# EAGLE board dash-hat (EAGLE 7.7.0)
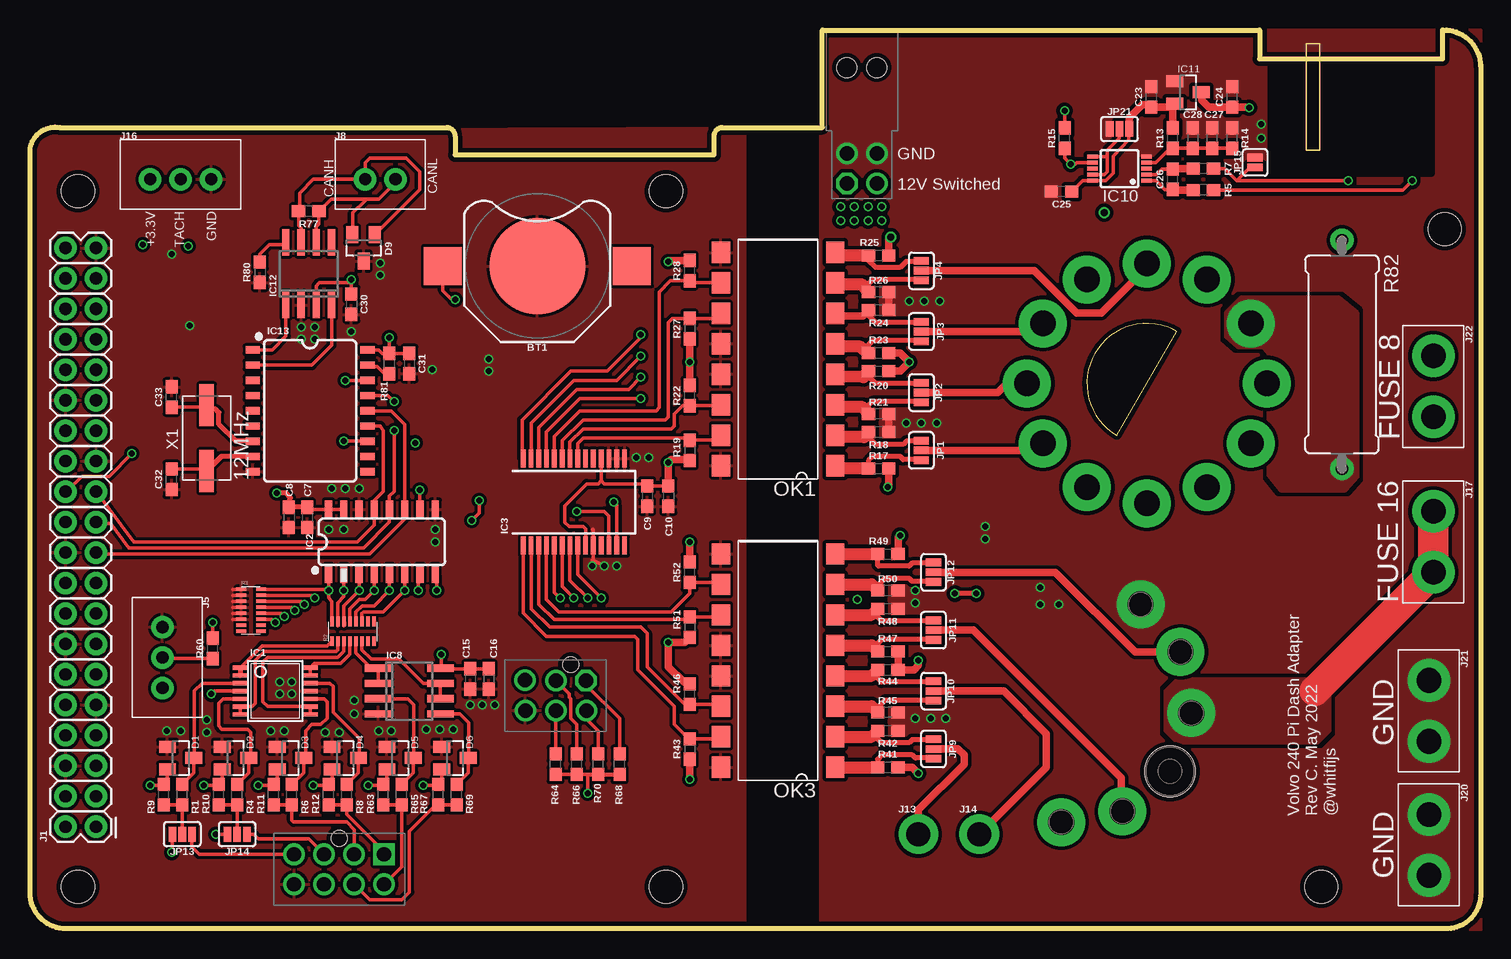
[diagram p2: board, top side]
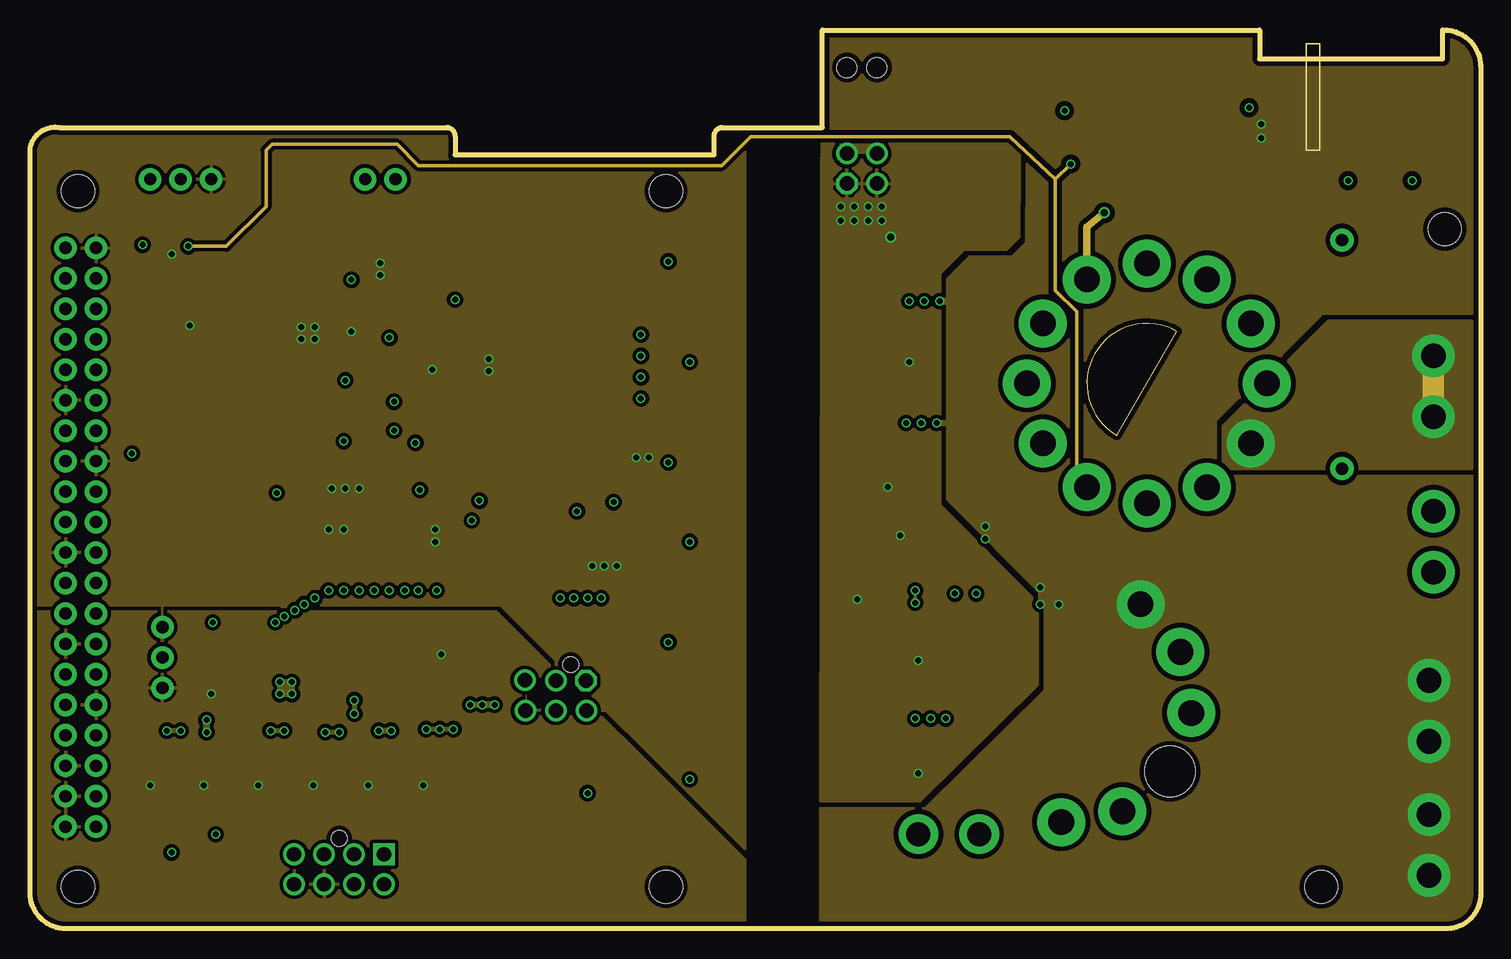
[diagram p3: board, inner layer Route2]
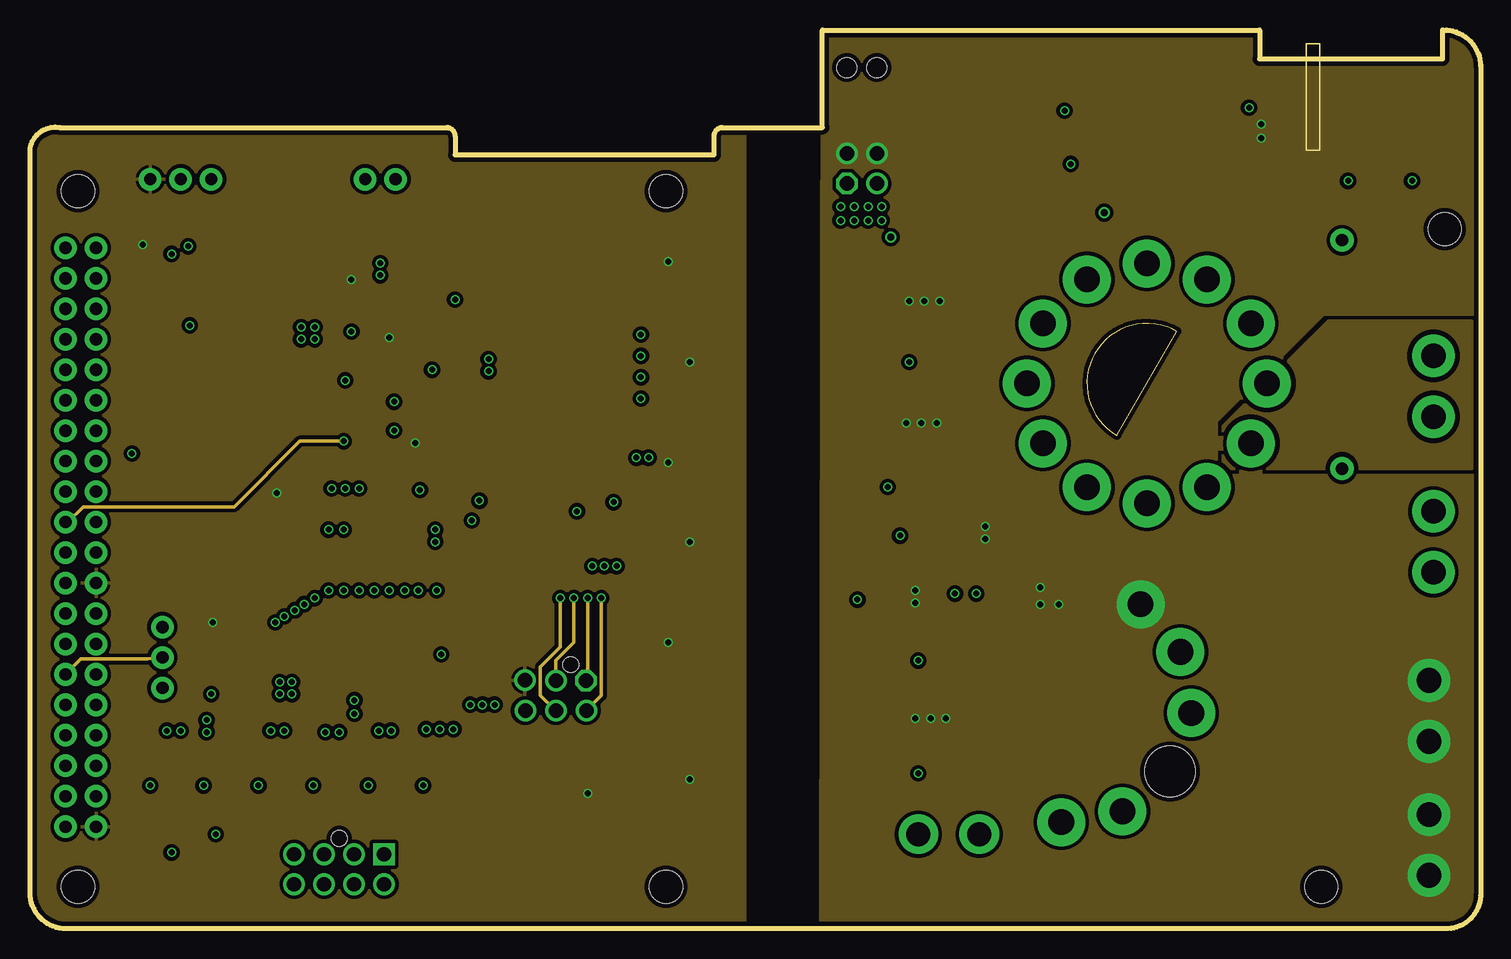
[diagram p4: board, inner layer Route15]
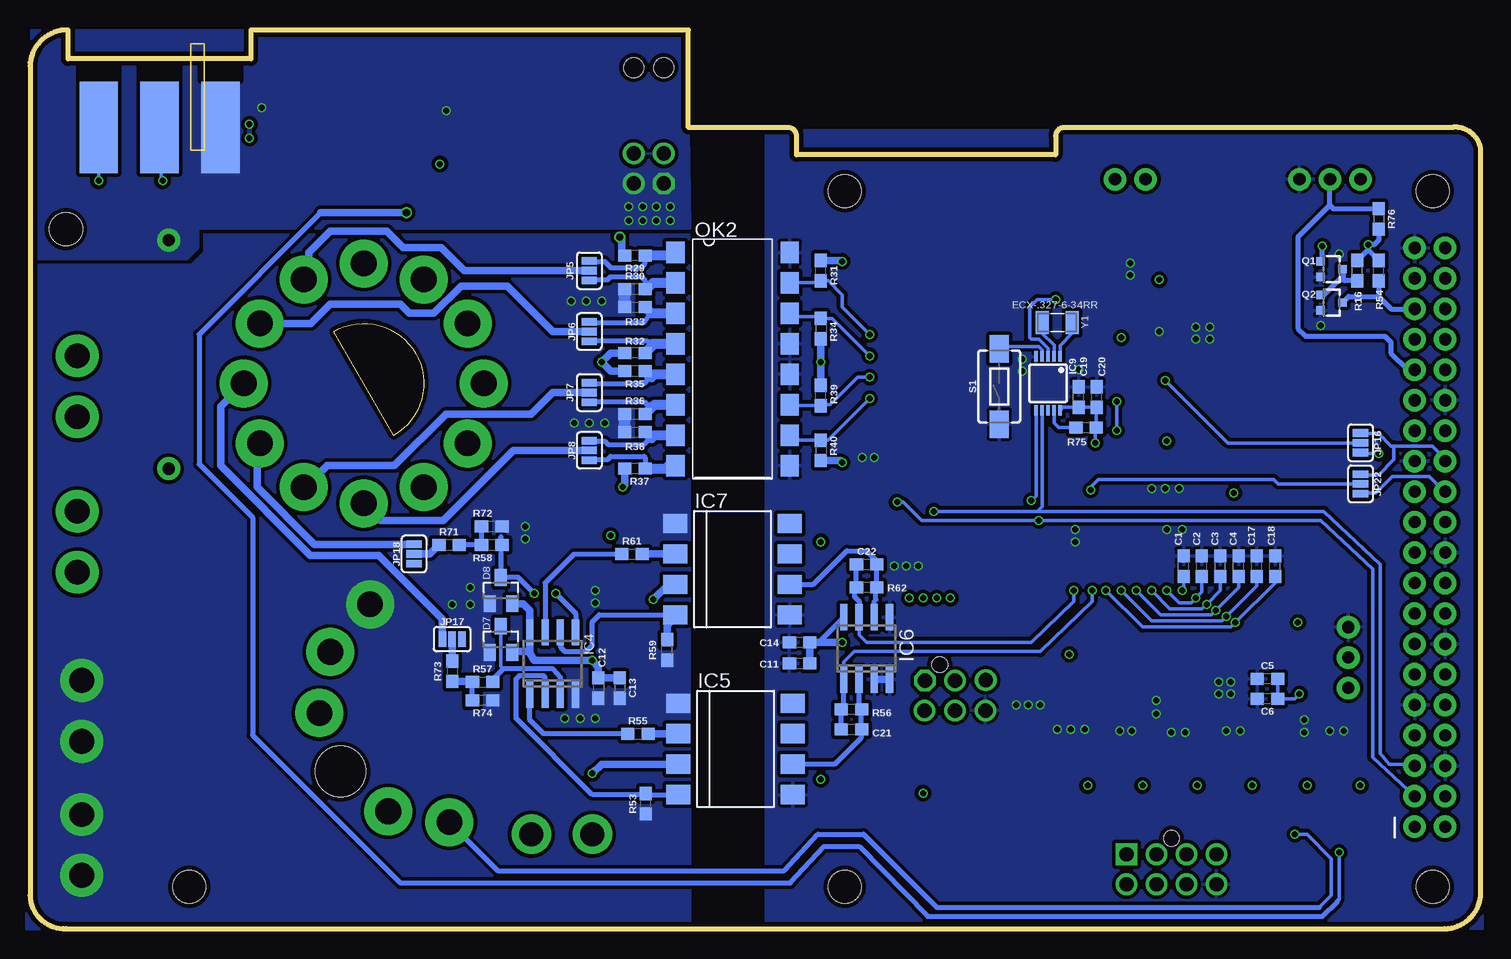
[diagram p5: board, bottom side, seen from below]

Size 120.89 x 74.93 mm. Coordinates in mm from the lower left corner, seen from the top.
Outline: 120.89,71.92 120.89,2.75 arc-90 117.89,0 3,0 arc-90 0,3 0,65.06 arc-90 2.49,66.79 34.7,66.8 arc-90 35.42,66.08 35.42,64.52 57.01,64.52 57.01,66.08 arc-90 57.73,66.8 66.03,66.8 66.03,74.93 102.47,74.93 102.47,72.52 117.71,72.52 117.71,74.93 117.76,74.93 arc-90 120.89,71.92
Copper layers (1*2*15*16): Top 0.035559375mm / dielectric 0.17018125mm / Route2 0.01778125mm / dielectric 47mil / Route15 0.01778125mm / dielectric 0.17018125mm / Bottom 0.035559375mm
Design rules "oshpark-4layer": minimum track width 5mil, minimum drill 10mil, track to track 5mil, track to pad 5mil, pad to pad 5mil, via to via 5mil, smd to smd 5mil, copper to edge 15mil, drill to drill 6mil, minimum pad ring 4mil, minimum via ring 4mil, stop-mask expansion 1.5mil, vias tented up to drill 0mil, thermal gap 10mil
Holes 2.75 mm at 53,3.5 53,61.5 4,3.5 4,61.5 107.61,3.5 117.9,58.33

## Footprints (pad centres in the part's own frame; a part is rotated, then mirrored left to right if it is on the bottom)
BATTCON_12MM = smd 8 x 8: GND 0,0 | smd 3.175 x 3.175: PWR@1 -7.874,0; PWR@2 7.874,0
0603 = smd 1.1 x 1: 1 -0.85,0; 2 0.85,0
SOT23 = smd 1 x 1.4: 1 -0.95,-1.1; 2 0.95,-1.1; 3 0,1.1
TSSOP14 = smd 1.26 x 0.36: 1 -2.918,1.95; 2 -2.918,1.3; 3 -2.918,0.65; 4 -2.918,0; 5 -2.918,-0.65; 6 -2.918,-1.3; 7 -2.918,-1.95; 8 2.918,-1.95; 9 2.918,-1.3; 10 2.918,-0.65; 11 2.918,0; 12 2.918,0.65; 13 2.918,1.3; 14 2.918,1.95
SO16 = smd 1.5 x 0.6: 1 -2.7,4.445; 2 -2.7,3.175; 3 -2.7,1.905; 4 -2.7,0.635; 5 -2.7,-0.635; 6 -2.7,-1.905; 7 -2.7,-3.175; 8 -2.7,-4.445; 9 2.7,-4.445; 10 2.7,-3.175; 11 2.7,-1.905; 12 2.7,-0.635; 13 2.7,0.635; 14 2.7,1.905; 15 2.7,3.175; 16 2.7,4.445
SSOP28 = smd 0.4 x 1.5: 1 -4.225,-3.625; 2 -3.575,-3.625; 3 -2.925,-3.625; 4 -2.275,-3.625; 5 -1.625,-3.625; 6 -0.975,-3.625; 7 -0.325,-3.625; 8 0.325,-3.625; 9 0.975,-3.625; 10 1.625,-3.625; 11 2.275,-3.625; 12 2.925,-3.625; 13 3.575,-3.625; 14 4.225,-3.625; 15 4.225,3.625; 16 3.575,3.625; 17 2.925,3.625; 18 2.275,3.625; 19 1.625,3.625; 20 0.975,3.625; 21 0.325,3.625; 22 -0.325,3.625; 23 -0.975,3.625; 24 -1.625,3.625; 25 -2.275,3.625; 26 -2.925,3.625; 27 -3.575,3.625; 28 -4.225,3.625
SO08 = smd 2.2 x 0.6: 1 -2.6,1.905; 2 -2.6,0.635; 3 -2.6,-0.635; 4 -2.6,-1.905; 5 2.6,-1.905; 6 2.6,-0.635; 7 2.6,0.635; 8 2.6,1.905
DIL8-SMD = smd 2 x 1.6: 1 -4.77,3.81; 2 -4.77,1.27; 3 -4.77,-1.27; 4 -4.77,-3.81; 5 4.77,-3.81; 6 4.77,-1.27; 7 4.77,1.27; 8 4.77,3.81
UMAX10 = smd 0.9 x 0.32: 1 -2.25,1; 2 -2.25,0.5; 3 -2.25,0; 4 -2.25,-0.5; 5 -2.25,-1; 6 2.25,-1; 7 2.25,-0.5; 8 2.25,0; 9 2.25,0.5; 10 2.25,1
SO18W = smd 0.6 x 1.2: 1 -5.08,-4.788; 2 -3.81,-4.788; 3 -2.54,-4.788; 4 -1.27,-4.788; 5 0,-4.788; 6 1.27,-4.788; 7 2.54,-4.788; 8 3.81,-4.788; 9 5.08,-4.788; 10 5.08,4.788; 11 3.81,4.788; 12 2.54,4.788; 13 1.27,4.788; 14 0,4.788; 15 -1.27,4.788; 16 -2.54,4.788; 17 -3.81,4.788; 18 -5.08,4.788
2X20 = drill 1.016 pad 1.88: 1 0,0; 2 0,2.54; 3 2.54,0; 4 2.54,2.54; 5 5.08,0; 6 5.08,2.54; 7 7.62,0; 8 7.62,2.54; 9 10.16,0; 10 10.16,2.54; 11 12.7,0; 12 12.7,2.54; 13 15.24,0; 14 15.24,2.54; 15 17.78,0; 16 17.78,2.54; 17 20.32,0; 18 20.32,2.54; 19 22.86,0; 20 22.86,2.54; 21 25.4,0; 22 25.4,2.54; 23 27.94,0; 24 27.94,2.54; 25 30.48,0; 26 30.48,2.54; 27 33.02,0; 28 33.02,2.54; 29 35.56,0; 30 35.56,2.54; 31 38.1,0; 32 38.1,2.54; 33 40.64,0; 34 40.64,2.54; 35 43.18,0; 36 43.18,2.54; 37 45.72,0; 38 45.72,2.54; 39 48.26,0; 40 48.26,2.54
MOLEX-1053102108 = drill 1.2 square: 1 3.75,1.25 | drill 1.2 pad 1.7: 2 1.25,1.25; 3 -1.25,1.25; 4 -3.75,1.25; 5 3.75,-1.25; 6 1.25,-1.25; 7 -1.25,-1.25; 8 -3.75,-1.25 | hole 1.3: 0,2.59
MOLEX-1053141204 = drill 1.2 pad 1.7 octagon: 1 -1.25,-1.25 | drill 1.2 pad 1.7: 2 1.25,-1.25; 3 -1.25,1.25; 4 1.25,1.25 | hole 1.65: -1.25,8.43; 1.25,8.43
1X03_JST-XHP = drill 1.016 pad 1.88: 1 0,0; 2 2.54,0; 3 5.08,0
VOLVO_CON_31 = drill 2.134 pad 4: 1 -10,0; 2 -8.66,-5; 3 -5,-8.66; 4 0,-10; 5 5,-8.66; 6 8.66,-5; 7 10,0; 8 8.66,5; 9 5,8.66; 10 0,10; 11 -5,8.66; 12 -8.66,5
VOLVO_CON_32 = drill 2.134 pad 4: 1 8.66,5; 2 5,8.66; 3 -8.66,5; 4 -10,0; A -5,8.66 | hole 4.2: 0,10
1X02_JST-XHP = drill 1.016 pad 1.88: 1 0,0; 2 2.54,0
MOLEX-1053101106 = drill 1.2 pad 1.7 octagon: 1 1.25,1.25 | drill 1.2 pad 1.7: 2 -1.25,1.25; 3 -3.83,1.29; 4 1.29,-1.25; 5 -1.25,-1.25; 6 -3.79,-1.25 | hole 1.3: 0,2.59
VOLVO_CONN_VSS = smd 7.62 x 3.175: 1 -5.715,0; + -5.715,-5.08; G -5.715,5.08
1X01_2MM = drill 2 pad 3.302: 1 0,0
1X02_XTRA_BIG = drill 2.057 pad 3.556: 1 -2.54,0; 2 2.54,0
SMT-JUMPER_3_NO_SILK = smd 0.635 x 1.27: 1 -0.813,0; 2 0,0; 3 0.813,0
SMT-JUMPER_2_NO_SILK = smd 0.635 x 1.27: 1 -0.406,0; 2 0.406,0
SMD16 = smd 1.524 x 1.778: 1 -4.763,8.89; 2 -4.763,6.35; 3 -4.763,3.81; 4 -4.763,1.27; 5 -4.763,-1.27; 6 -4.763,-3.81; 7 -4.763,-6.35; 8 -4.763,-8.89; 9 4.763,-8.89; 10 4.763,-6.35; 11 4.763,-3.81; 12 4.763,-1.27; 13 4.763,1.27; 14 4.763,3.81; 15 4.763,6.35; 16 4.763,8.89
SOT323 = smd 0.7 x 0.7: 1 -0.65,-0.925; 2 0.65,-0.925; 3 0,0.925
YC248 = smd 0.8 x 0.3: 1 -0.8,1.75; 2 -0.8,1.25; 3 -0.8,0.75; 4 -0.8,0.25; 5 -0.8,-0.25; 6 -0.8,-0.75; 7 -0.8,-1.25; 8 -0.8,-1.75; 9 0.85,-1.75; 10 0.85,-1.25; 11 0.85,-0.75; 12 0.85,-0.25; 13 0.85,0.25; 14 0.85,0.75; 15 0.85,1.25; 16 0.85,1.75
0617/17 = drill 1.016 pad 1.93: 1 -9.525,0; 2 9.525,0
TACTILE_SWITCH_SMD_6.0X3.5MM = smd 2.3 x 1.6: 1 -3.15,0; 2 3.15,0
ECS = smd 3.5 x 1.2: 1 -2.75,0; 2 2.75,0
ECX-34RR = smd 1.1 x 1.9: 1 -1.25,0; 2 1.25,0

## Placement (x,y rotation side)
BT1  [BATTCON_12MM]  42.28,55.24 0 top
C1  100n  [0603]  24.75,30.23 90 bottom
C2  100n  [0603]  23.23,30.23 90 bottom
C3  100n  [0603]  21.7,30.23 90 bottom
C4  100n  [0603]  20.18,30.23 90 bottom
C5  100n  [0603]  17.77,20.83 180 bottom
C6  1u  [0603]  17.77,19.18 180 bottom
C7  100n  [0603]  23.1,34.29 270 top
C8  1u  [0603]  21.57,34.29 270 top
C9  100n  [0603]  51.42,36.07 270 top
C10  1u  [0603]  53.2,36.07 270 top
C11  100n  [0603]  56.75,22.1 180 bottom
C12  100n  [0603]  73.52,20.07 270 bottom
C13  1u  [0603]  71.74,20.07 270 bottom
C14  1u  [0603]  56.75,23.88 180 bottom
C15  100n  [0603]  36.69,20.83 270 top
C16  1u  [0603]  38.21,20.83 270 top
C17  100n  [0603]  18.65,30.23 90 bottom
C18  100n  [0603]  17.13,30.23 90 bottom
C19  100n  [0603]  33.51,44.32 90 bottom
C20  1u  [0603]  31.99,44.32 90 bottom
C21  100n  [0603]  52.44,16.64 0 bottom
C22  100n  [0603]  51.17,30.35 180 bottom
C23  100n  [0603]  93.46,69.34 90 top
C24  1u  [0603]  100.19,69.34 90 top
C25  100n  [0603]  85.96,61.47 180 top
C26  10n  [0603]  95.23,62.48 90 top
C27  100n  [0603]  98.54,65.91 90 top
C28  10u  [0603]  96.89,65.91 270 top
C30  100n  [0603]  26.78,52.07 270 top
C31  100n  [0603]  31.61,47.12 270 top
C32  22p  [0603]  11.8,37.47 90 top
C33  22p  [0603]  11.8,44.32 90 top
D1  BAT54S  [SOT23]  12.56,14.22 270 top
D2  BAT54S  [SOT23]  17.13,14.22 270 top
D3  BAT54S  [SOT23]  21.7,14.22 270 top
D4  BAT54S  [SOT23]  26.27,14.22 270 top
D5  BAT54S  [SOT23]  30.85,14.22 270 top
D6  BAT54S  [SOT23]  35.42,14.22 270 top
D7  BAT54S  [SOT23]  81.65,24.13 0 bottom
D8  BAT54S  [SOT23]  81.65,28.19 0 bottom
D9  PESD1CAN  [SOT23]  27.8,56.77 180 top
IC1  LMV614  [TSSOP14]  20.43,19.81 0 top
IC2  MCP3X083008  [SO16]  29.32,32.26 90 top
IC3  MCP23017SS  [SSOP28]  45.32,35.56 0 top
IC4  LM358D  [SO08]  77.33,22.1 90 bottom
IC5  IL300  [DIL8-SMD]  62.09,14.99 0 bottom
IC6  TSV912D  [SO08]  51.17,23.37 90 bottom
IC7  IL300-DEFG-X007T  [DIL8-SMD]  62.34,29.97 0 bottom
IC8  TSV912D  [SO08]  31.61,19.81 0 top
IC9  DS1374  [UMAX10]  36.05,45.47 270 bottom
IC10  MAX9924  [UMAX10]  90.79,63.37 180 top
IC11  ZXTR2105FQ  [SOT23]  96.51,69.72 270 top
IC12  SN65HVD230D  [SO08]  23.23,54.61 90 top
IC13  MCP2515  [SO18W]  23.35,43.18 270 top
J1  CONN_20X2  [2X20]  5.5,8.5 90 top
J2  CONN_04X2  [MOLEX-1053102108]  25.77,4.95 0 top
J3  CONN_04RIGHT-ANGLE  [MOLEX-1053141204]  69.33,63.37 0 top
J5  PWM_OUT  [1X03_JST-XHP]  11.03,25.15 270 top
J6  VOLVO_CONN_31  [VOLVO_CON_31]  93.08,45.47 270 top
J7  VOLVO_CONN_32  [VOLVO_CON_32]  86.81,18.85 235 top
J8  [1X02_JST-XHP]  27.93,62.48 0 top
J9  CONN_03X2  [MOLEX-1053101106]  45.07,19.43 0 top
J11  VOLVO_CONN_VSS  [VOLVO_CONN_VSS]  110.09,72.52 90 bottom
J13  [1X01_2MM]  74.03,7.87 0 top
J14  [1X01_2MM]  79.11,7.87 0 top
J16  TACH_IN  [1X03_JST-XHP]  10.02,62.48 0 top
J17  [1X02_XTRA_BIG]  116.95,32.26 270 top
J20  [1X02_XTRA_BIG]  116.57,6.99 270 top
J21  [1X02_XTRA_BIG]  116.57,18.16 270 top
J22  [1X02_XTRA_BIG]  116.95,45.21 270 top
JP1  IN1_SEL  [SMT-JUMPER_3_NO_SILK]  74.28,39.88 90 top
JP2  IN2_SEL  [SMT-JUMPER_3_NO_SILK]  74.28,44.7 270 top
JP3  IN3_SEL  [SMT-JUMPER_3_NO_SILK]  74.28,49.78 90 top
JP4  IN4_SEL  [SMT-JUMPER_3_NO_SILK]  74.28,54.86 270 top
JP5  IN5_SEL  [SMT-JUMPER_3_NO_SILK]  74.28,54.86 270 bottom
JP6  IN6_SEL  [SMT-JUMPER_3_NO_SILK]  74.28,49.78 90 bottom
JP7  IN7_SEL  [SMT-JUMPER_3_NO_SILK]  74.28,44.7 270 bottom
JP8  IN8_SEL  [SMT-JUMPER_3_NO_SILK]  74.28,39.88 90 bottom
JP9  IN9_SEL  [SMT-JUMPER_3_NO_SILK]  75.3,14.99 90 top
JP10  IN10_SEL  [SMT-JUMPER_3_NO_SILK]  75.3,19.81 270 top
JP11  IN11_SEL  [SMT-JUMPER_3_NO_SILK]  75.3,24.89 90 top
JP12  IN12_SEL  [SMT-JUMPER_3_NO_SILK]  75.3,29.72 270 top
JP13  JUMPER-SMT_3_NO_SILK  [SMT-JUMPER_3_NO_SILK]  12.69,7.87 180 top
JP14  JUMPER-SMT_3_NO_SILK  [SMT-JUMPER_3_NO_SILK]  17.26,7.87 180 top
JP15  VSS- Jumper  [SMT-JUMPER_2_NO_SILK]  102.09,63.88 90 top
JP16  SPI_CS_SEL  [SMT-JUMPER_3_NO_SILK]  10.02,40.51 270 bottom
JP17  JUMPER-SMT_3_NO_SILK  [SMT-JUMPER_3_NO_SILK]  85.71,24.13 180 bottom
JP18  JUMPER-SMT_3_NO_SILK  [SMT-JUMPER_3_NO_SILK]  88.89,31.24 90 bottom
JP21  SPI_CS_SEL  [SMT-JUMPER_3_NO_SILK]  90.79,66.67 0 top
JP22  SPI_CS_SEL  [SMT-JUMPER_3_NO_SILK]  10.02,37.08 270 bottom
OK1  ILQ1X009  [SMD16]  62.34,47.5 180 top
OK2  ILQ1X009  [SMD16]  62.34,47.5 0 bottom
OK3  ILQ1X009  [SMD16]  62.34,22.35 180 top
Q1  310mA/60V/1.6Ω  [SOT323]  12.43,54.99 270 bottom
Q2  310mA/60V/1.6Ω  [SOT323]  12.43,52.2 270 bottom
R1  100R  [0603]  12.69,11.18 90 top
R2  8.2k  [YC248]  26.91,24.77 90 top
R3  15k  [YC248]  18.4,26.54 0 top
R4  100R  [0603]  17.26,11.18 90 top
R5  10k 1%  [0603]  97.78,61.59 180 top
R6  100R  [0603]  21.83,11.18 90 top
R7  10k 1%  [0603]  97.78,63.37 180 top
R8  100R  [0603]  26.4,11.18 90 top
R9  1k  [0603]  11.16,11.18 90 top
R10  1k  [0603]  15.73,11.18 90 top
R11  1k  [0603]  20.3,11.18 90 top
R12  1k  [0603]  24.88,11.18 90 top
R13  1k  [0603]  95.23,65.91 90 top
R14  1k  [0603]  100.19,65.91 90 top
R15  1k  [0603]  86.22,65.91 90 top
R16  20k  [0603]  10.27,54.86 90 bottom
R17  470R  [0603]  70.72,38.35 0 top
R18  470R  [0603]  70.72,41.4 180 top
R19  1k  [0603]  54.98,39.88 270 top
R20  470R  [0603]  70.72,46.48 0 top
R21  470R  [0603]  70.72,42.93 180 top
R22  1k  [0603]  54.98,44.45 90 top
R23  470R  [0603]  70.72,48.01 0 top
R24  470R  [0603]  70.72,51.56 180 top
R25  470R  [0603]  70.72,56.13 0 top
R26  470R  [0603]  70.72,53.09 180 top
R27  1k  [0603]  54.98,50.04 270 top
R28  1k  [0603]  54.98,54.86 90 top
R29  470R  [0603]  70.47,56.13 180 bottom
R30  470R  [0603]  70.47,53.34 0 bottom
R31  1k  [0603]  54.98,54.86 90 bottom
R32  470R  [0603]  70.47,48.01 180 bottom
R33  470R  [0603]  70.47,51.82 0 bottom
R34  1k  [0603]  54.98,50.04 270 bottom
R35  470R  [0603]  70.47,46.48 180 bottom
R36  470R  [0603]  70.47,42.93 0 bottom
R37  470R  [0603]  70.47,38.35 180 bottom
R38  470R  [0603]  70.47,41.4 0 bottom
R39  1k  [0603]  54.98,44.45 90 bottom
R40  1k  [0603]  54.98,39.88 270 bottom
R41  470R  [0603]  71.49,13.46 0 top
R42  470R  [0603]  71.49,16.51 180 top
R43  1k  [0603]  54.98,14.99 270 top
R44  470R  [0603]  71.49,21.59 0 top
R45  470R  [0603]  71.49,18.03 180 top
R46  1k  [0603]  54.98,19.56 90 top
R47  470R  [0603]  71.49,23.11 0 top
R48  470R  [0603]  71.49,26.67 180 top
R49  470R  [0603]  71.49,31.24 0 top
R50  470R  [0603]  71.49,28.19 180 top
R51  1k  [0603]  54.98,25.15 270 top
R52  1k  [0603]  54.98,29.72 90 top
R53  100k 1%  [0603]  69.58,10.41 90 bottom
R54  20k  [0603]  8.49,54.86 90 bottom
R55  270 1%  [0603]  70.22,16.26 0 bottom
R56  20k 1%  [0603]  52.44,18.29 180 bottom
R57  100R  [0603]  83.17,20.57 0 bottom
R58  100R  [0603]  82.41,32 0 bottom
R59  100k 1%  [0603]  67.8,23.24 90 bottom
R60  20k  [0603]  15.23,23.37 90 top
R61  270 1%  [0603]  70.72,31.24 0 bottom
R62  20k 1%  [0603]  51.17,28.45 180 bottom
R63  1k  [0603]  29.45,11.18 90 top
R64  1k  [0603]  43.8,13.72 90 top
R65  100R  [0603]  30.97,11.18 90 top
R66  1k  [0603]  45.58,13.72 90 top
R67  1k  [0603]  34.02,11.18 90 top
R68  1k  [0603]  49.13,13.72 90 top
R69  100R  [0603]  35.54,11.18 90 top
R70  1k  [0603]  47.36,13.72 90 top
R71  100k 1%  [0603]  85.96,32 0 bottom
R72  100k 1%  [0603]  82.41,33.53 180 bottom
R73  100k 1%  [0603]  85.71,21.46 270 bottom
R74  100k 1%  [0603]  83.17,19.05 180 bottom
R75  1k  [0603]  32.88,41.78 0 bottom
R76  20k  [0603]  8.49,59.18 270 bottom
R77  120 1%  [0603]  23.23,59.82 180 top
R80  1k  [0603]  19.16,54.74 270 top
R81  20k  [0603]  29.96,47.12 90 top
R82  RES_D+  [0617/17]  109.33,47.88 90 top
S1  RST_SW  [TACTILE_SWITCH_SMD_6.0X3.5MM]  40.12,45.21 90 bottom
X1  12MHz  [ECS]  14.72,40.89 90 top
Y1  ECX-.327-6-34RR  [ECX-34RR]  35.29,50.55 0 bottom

## Tracks (layer width: path | path; a pad name or v marks a point on that pad's centre or on a via)
3.3V  (via drill 0.5)
  Top 0.305: IC2.15 IC2.16 23.28,34.96 C7.1 | C10.1 C9.1 arc-90 51.25,37.08 47.86,37.08 47.6,37.35 | 47.6,37.35 IC3.18 | IC3.9 46.3,33.31 46.09,33.53 44.92,33.53 44.56,33.89 44.56,35.25 46.39,37.08 47.33,37.08 47.6,37.35 | R60.2 v15.23,25.53 | IC13.18 29.07,48.26 29.36,47.97 R81.2 | R81.2 C31.1 | IC12.3 23.86,53.59 24.12,53.85 26.69,53.85 26.78,53.76 C30.1 v26.78,54.1 | v29.96,49.28 R81.2 | R64.1 R66.1 R70.1 R68.1 49.09,12.83 46.47,12.83 v46.47,11.3
  Top 0.406: IC2.16 24.92,35 | C7.1 C8.1 21.7,35.94 21.36,36.32 v20.56,36.32
  Top 0.61: R52.2 v54.98,32.26 | R51.2 54.56,23.88 v53.2,23.88 53.2,21.84 54.47,20.57 54.98,20.57 R46.2 | R43.2 v54.98,12.45 | C10.1 v53.2,38.86 53.45,39.12 54.89,39.12 R40.2 | R39.2 v54.98,47.24 R34.2 | R31.2 53.29,55.71 v53.2,55.63
  Bottom 0.305: IC9.10 34.8,43.47 C19.1 C20.1 32.03,43.43 R75.2 32.12,41.74 v32.12,40.51
  Bottom 0.406: IC6.8 55.16,23.88 55.74,23.88 | R54.2 9.38,56.6 | R16.2 9.38,56.6 | 9.38,56.6 v9.38,57.02 8.88,57.02 8.49,57.4 R76.2
  Bottom 0.61: C11.1 C14.1 55.74,23.88 v53.2,23.88 | R40.2 53.36,39.03 v53.2,38.86 | R39.2 v54.98,47.24 R34.2 | R31.2 53.29,55.71 v53.2,55.63
  pour Route15 (isolate 0.305): 0.11,66.8 59.55,67.06 59.55,0.25 0.11,0
5V  (via drill 0.5)
  Top 0.305: D1.2 11.46,12.2 R9.2 11.2,11.94 v10.02,11.94 | D2.2 16.03,12.2 R10.2 15.77,11.94 v14.46,11.94 | D3.2 20.6,12.2 R11.2 20.34,11.94 v19.04,11.94 | D4.2 25.17,12.2 R12.2 24.92,11.94 v23.61,11.94 | D5.2 29.75,12.2 R63.2 29.49,11.94 v28.18,11.94 | D6.2 34.32,12.2 R67.2 34.06,11.94 v32.75,11.94 | IC1.4 15.35,19.81 v15.1,19.56 | IC8.8 34.25,21.68 | 34.25,21.68 C15.1 C16.1 | 34.25,21.68 34.27,21.71 v34.27,22.86
  Bottom 0.305: v15.1,19.56 15.48,19.18 C6.1 C5.1
  pour Route2 (isolate 0.305): -0.14,26.42 38.86,26.42 59.55,5.73 59.55,0 -0.14,0
12V  (via drill 0.5, 0.6)
  Top 0.305: 97.78,69.55 IC11.3 | 101.55,68.49 v101.59,68.45 | R15.2 v86.22,68.2
  Top 0.61: R25.2 71.57,57.49 v71.74,57.66 | R23.2 72.5,48.01 v73.26,47.24 72.5,46.48 R20.2 | R17.2 71.57,36.92 v71.49,36.83 | R49.2 72.34,32.6 v72.5,32.77 | v74.03,22.35 74.03,21.95 73.67,21.59 R44.2 R47.2 | R41.2 73.52,13.46 v74.03,12.95 | C24.1 101.55,68.49 | C24.1 100.15,68.45 | 97.61,69.39 IC11.3 97.65,69.68 97.65,69.09 98.24,68.49 C24.1
  Bottom 0.61: C13.1 C12.1 73.52,21.84 v74.03,22.35 78.85,22.35 79.23,22.99 79.23,23.11 | 79.23,23.11 IC4.8 79.23,26.54 79.78,27.09 D8.2 | R37.2 71.32,37 v71.49,36.83 | R35.2 72.5,46.48 v73.26,47.24 72.5,48.01 R32.2 | IC7.3 67.68,28.7 v68.95,27.43 | IC5.3 73.26,13.72 v74.03,12.95 | R29.2 R25.2 71.57,57.49 v71.74,57.66 | D7.2 80.61,23.11 79.23,23.11
  other vias: 67.55,59.05 67.55,60.2 68.69,60.2 68.69,59.05 69.84,59.05 69.84,60.2 70.98,60.2 70.98,59.05
  pour Bottom (isolate 0.305, no thermals): 66.15,74.8 65.9,58.42 106.92,58.42 106.92,56.8 107.83,55.88 120.51,55.88 120.76,74.93
  pour Route2 (isolate 0.305): 82.54,75.06 82.41,57.66 81.39,56.64 77.84,56.64 75.8,54.61 75.8,35.31 83.93,27.18 83.93,20.32 74.15,10.67 65.9,10.67 66.03,75.06
12V-FUSE_8
  Route2 1.778: J22.1 J22.2
  Bottom 0.61: J6.9 101.97,40.24 101.97,36.83 97.19,32.05 JP18.3
  pour Route2 (isolate 0.406, no thermals): 99.43,38.35 99.43,41.91 108.19,50.67 120.13,50.67 120.13,38.35
12V-FUSE_16
  Top 2.54: J17.1 J17.2 107.05,19.81
  pour Top (isolate 0.305, no thermals): 108.32,20.83 95.62,20.83 94.6,19.81 94.6,16.51 95.62,15.49 107.3,15.49 108.32,16.51
!CAN_SPI_CS  (via drill 0.5)
  Top 0.305: IC13.16 v26.27,45.72
  Bottom 0.305: v26.27,45.72 21.07,40.51 JP16.2
!SPI_CS  (via drill 0.5)
  Top 0.305: v32.5,36.58 IC2.10
  Bottom 0.305: JP22.2 16.88,37.08 17.26,37.47 31.86,37.47 32.5,36.83 v32.5,36.58
AC_RELAY/VSS_TO_ECU  (via drill 0.5)
  Top 0.305: IC10.7 87.23,63.87 87.11,63.75 v86.73,63.75 86.22,64.26 R15.1
  Route2 0.305: v86.73,63.75 85.46,62.48 | 85.46,62.48 85.46,53.21 87.23,51.44 87.23,38.35 88.08,37.51 J6.6 | 85.46,62.48 81.65,66.04 60.06,66.04 57.64,63.63 32.37,63.63 30.59,65.41 20.18,65.41 19.67,64.9 19.67,60.2 16.37,56.9 v13.19,56.9 13.19,57.15
  Bottom 0.406: Q1.1 13.19,55.8 v13.19,56.9
ADC1_IN  (via drill 0.5)
  Top 0.305: IC2.1 24.88,28.32 | 24.88,28.32 v24.88,28.19 | v24.88,28.19 24.88,27.56 25.16,27.28 R2.16 | 24.85,28.29 arc90 24.88,28.32 | R3.16 24.78,28.29 v24.88,28.19
  Bottom 0.305: C1.1 24.75,28.32 v24.88,28.19
ADC2_IN  (via drill 0.5)
  Top 0.305: IC2.2 v26.15,28.19 26.15,27.69 25.64,27.18 25.64,25.23 R2.15 | R3.15 23.5,27.79 v23.73,27.56
  Bottom 0.305: C2.1 23.23,28.07 v23.73,27.56 24.12,27.18 25.13,27.18 v26.15,28.19
ADC3_IN  (via drill 0.5)
  Top 0.305: IC2.3 v27.42,28.19 26.15,26.92 26.15,25.25 arc90 R2.14 | R3.14 22.6,27.29 v22.84,27.05
  Bottom 0.305: v27.42,28.19 25.89,26.67 23.23,26.67 v22.84,27.05 21.7,28.19 C3.1
ADC4_IN  (via drill 0.5)
  Top 0.305: IC2.4 v28.69,28.19 27.93,27.43 27.42,27.43 26.66,26.67 R2.13 | R3.13 21.83,26.79 v22.08,26.54
  Bottom 0.305: v28.69,28.19 26.66,26.16 22.46,26.16 v22.08,26.54 20.18,28.45 C4.1
ADC5_IN  (via drill 0.5)
  Top 0.305: 29.96,27.94 v29.96,28.19 | v29.96,28.19 IC2.5 | R3.12 20.94,26.29 v21.19,26.04 | R2.12 27.16,25.65 27.16,26.42 27.67,26.92 28.69,26.92 v29.96,28.19
  Bottom 0.305: v29.96,28.19 27.42,25.65 21.57,25.65 v21.19,26.04 18.65,28.57 C17.1
ADC6_IN  (via drill 0.5)
  Top 0.305: IC2.6 v31.23,28.19 29.45,26.42 27.8,26.42 27.66,26.28 R2.11 | R3.11 20.17,25.79 v20.43,25.53
  Bottom 0.305: v31.23,28.19 28.18,25.15 20.81,25.15 v20.43,25.53 17.13,28.83 C18.1
BLINKER_LEFT_P
  Bottom 0.61: JP7.2 77.33,44.7 79.11,42.93 86.22,42.93 90.54,38.61 96.12,38.61 97.93,36.81 J6.8
BLINKER_RIGHT_P
  Bottom 0.61: J6.7 91.65,34.04 86.47,34.04 80.63,39.88 JP8.2
BRAKE_FAILURE_N
  Top 0.61: JP4.2 83.68,54.86 87.23,51.31 89.27,51.31 92.7,54.74 92.7,55.09 J6.1
BULB_FAILURE_N
  Bottom 0.61: J6.12 97.65,54.55 97.65,56.39 95.87,58.17 91.17,58.17 89.77,56.77 86.6,56.77 84.69,54.86 JP5.2
CANH
  Top 0.305: IC12.7 22.59,58.42 22.38,58.63 R77.2 22.46,59.91 22.46,61.34 23.61,62.48 J8.1 27.93,63.88 28.31,64.26 31.35,64.26 32.5,63.12 32.5,61.62 D9.1
CANL
  Top 0.305: IC12.6 23.86,58.55 24.08,58.76 R77.1 25.09,60.83 27.93,60.83 | D9.2 26.91,57.93 26.91,59.69 27.93,60.71 27.93,60.83 | 27.93,60.83 29.07,60.83 30.46,62.23 J8.2
CHARGING_N
  Bottom 0.61: JP6.2 77.33,49.78 81.14,53.59 84.95,53.59 87.23,51.31 89.27,51.31 90.03,52.07 95.87,52.07 97.47,50.47 J6.11
  pour Top (isolate 0.305, no thermals): 103.24,48.01 103.24,37.82 104.23,36.58 109.61,36.58 110.6,37.69 110.6,51.31 109.06,52.58 100.95,52.58 99.68,51.31 99.68,49.4 100.7,48.51 102.73,48.51
CHECK_ENGINE_N
  Top 0.61: JP10.2 81.14,19.81 84.69,16.26 84.69,13.46 J14.1
CONN_32_PIN3
  Top 0.61: JP12.2 85.46,29.72 92.1,23.08 J7.3
COOLANT_TEMP_SENSOR  (via drill 0.5, 0.6)
  Top 0.305: v11.8,6.35 11.87,6.43 JP13.3
  Route2 0.61: J6.2 88.08,58.5 v89.52,59.69
  Bottom 0.305: 11.92,2.29 11.8,2.41 v11.8,6.35
  Bottom 0.406: 96.64,59.69 106.79,49.54 106.79,38.73 102.35,34.29 102.35,16.13 90.03,3.81 57.52,3.81 54.72,6.86 51.8,6.86 46.09,1.02 13.19,1.02 11.92,2.29
  Bottom 0.61: v89.52,59.69 96.64,59.69
DIMMER_VOUT
  Bottom 0.61: J6.10 105.01,43.53 105.01,38.61 97.52,31.11 91.81,31.11 86.52,25.83 JP17.3
FUEL_LVL_SENDER  (via drill 0.5)
  Top 0.305: v15.48,7.87 JP14.3
  Bottom 0.305: 13.45,1.78 12.43,2.79 12.43,5.84 14.46,7.87 v15.48,7.87
  Bottom 0.406: 85.94,8.86 81.9,4.83 58.02,4.83 55.23,7.87 51.42,7.87 45.32,1.78 13.45,1.78
  Bottom 0.61: J7.1 85.94,8.86
GND  (via drill 0.5)
  Top 0.305: IC3.10 46.95,33.27 46.85,33.27 arc-90 46.95,33.17 46.95,30.84 46.85,30.73 v47.86,30.23 | 16.88,28.3 R3.1 | 16.88,27.79 R3.2 | 16.88,27.29 R3.3 | 17.38,26.8 16.88,26.8 16.88,26.79 R3.4 | 16.88,26.29 17.38,26.29 R3.5 | 16.88,25.78 17.38,25.78 17.38,25.79 R3.6
  Bottom 0.61: IC6.3 IC6.4
  other vias: 50.53,39.27 51.55,39.27 27.42,36.7 26.27,36.7 24.88,33.27 26.15,33.27 46.85,30.23 48.88,30.23 33,16.64 35.29,16.64 34.15,16.64 38.21,47.5 33.77,33.27 33.77,32.26 37.7,18.67 38.72,18.67 36.69,18.67 25.13,36.7 11.8,56.26 13.32,50.29 21.83,19.56 20.81,19.56 21.83,20.57 20.81,20.57 20.05,16.51 21.19,16.51 14.72,16.38 14.72,17.4 25.77,16.38 24.62,16.38 12.56,16.51 11.42,16.51 27.04,17.91 27.04,19.05 30.08,16.51 29.07,16.51 38.21,46.48 22.59,50.16 22.59,49.15 23.73,49.15 23.73,50.16 29.2,55.5 29.2,54.48 26.78,49.78 33.51,46.61
  pour Top (isolate 0.254): 0.62,0.25 0.37,66.55 59.55,66.8 59.55,0.25
  pour Bottom (isolate 0.305): -0.14,0 0.37,66.55 59.55,66.55 59.55,0.25
  pour Route2 (isolate 0.305, rank 2): 0.62,0.51 59.55,0.51 59.55,66.55 0.37,66.55
GND-ISO  (via drill 0.5)
  Top 0.61: R21.1 R18.1 | R26.1 R24.1
  Bottom 1.016: R38.1 R36.1 | R33.1 R30.1
  other vias: 73.77,17.53 75.04,17.53 76.31,17.53 73.01,42.16 74.28,42.16 75.55,42.16 73.26,52.32 74.53,52.32 75.8,52.32 79.61,32.51 79.61,33.53 73.77,28.19 73.77,27.18 84.19,27.05 84.19,28.45 85.71,27.05 102.6,67.06 102.6,65.91
  pour Top (isolate 0.305, rank 2, no thermals): 65.9,74.93 109.05,74.93 120.88,74.9 120.9,-0.1 106.13,0 65.9,0
  pour Bottom (isolate 0.305, rank 2, no thermals): 120.88,74.97 121.15,0.01 106.02,0 65.9,0 66.03,74.93 109.5,74.93
  pour Route15 (isolate 0.305, rank 2, no thermals): 66.03,74.93 121.02,75.06 120.89,0.13 65.9,0
  pour Route2 (isolate 0.406, rank 2, no thermals): 66.03,74.93 65.9,0 120.89,0 120.89,74.93
GPIO6
  Top 0.406: J1.31
  Bottom 0.406: 12.56,60.33 15.23,57.66 15.23,50.04 14.59,49.4 7.99,49.4 7.48,48.9 7.48,48.01 6.07,46.6 J1.31 | 12.56,62.1 J16.2 12.56,60.33 | 12.56,60.33 12.27,60.03 R76.1
GPIO17
  Top 0.406: J1.11 5.84,21.54
GPIO18
  Top 0.305: J5.2 11.58,22.52 R60.1
  Route15 0.305: J1.12 4.24,22.48 9.76,22.48 J5.2
GPIO19
  Bottom 0.406: R54.1 8.49,52.7 | 8.49,52.7 7.47,51.68 J1.35 | Q2.3 11,52.7 8.49,52.7
GPIO25  (via drill 0.5)
  Top 0.305: IC13.12 v26.15,40.64
  Route15 0.305: v26.15,40.64 22.46,40.64 17,35.18 4.43,35.18 3.15,33.9 J1.22
GPIO27
  Top 0.406: J1.13 6.07,23.16
HIGH_BEAM_P
  Top 0.61: J6.3 83.73,49.78 JP3.2
IN1_12V_SIGNAL
  Bottom 0.406: R74.2 R57.1
  Bottom 0.61: R57.1 84.06,20.61 R73.2
IN1N
  Top 0.406: JP1.3 74.23,40.64 73.01,40.64 72.76,40.39 70.47,40.39 69.87,40.98 R18.2
  Top 1.016: R18.2 69.49,40.99 66.91,40.99 OK1.2
IN1P
  Top 0.406: JP1.1 74.23,39.12 72.76,39.12 72.5,39.37 70.22,39.37 69.87,39.03 R17.1
  Top 1.016: R17.1 67.42,38.35 67.17,38.44 OK1.1
IN2N
  Top 0.406: JP2.3 74.23,43.94 70.22,43.94 69.87,43.6 R21.2
  Top 1.016: R21.2 69.39,43.49 67.42,43.49 OK1.3
IN2P
  Top 0.406: JP2.1 74.23,45.47 70.47,45.47 69.87,46.06 R20.1
  Top 1.016: R20.1 69.45,45.97 67.17,46.04 OK1.4
IN3N
  Top 0.406: JP3.3 74.23,50.55 70.47,50.55 69.87,51.14 R24.2
  Top 0.61: 67.17,51.09 69.4,51.09 R24.2
  Top 1.016: 67.17,51.09 OK1.6
IN3P
  Top 0.406: JP3.1 74.23,49.02 70.22,49.02 69.87,48.68 R23.1
  Top 1.016: R23.1 69.2,48.51 67.42,48.54 OK1.5
IN4N
  Top 0.406: JP4.3 74.23,54.1 70.22,54.1 69.87,53.76 R26.2
  Top 1.016: R26.2 69.39,53.69 67.17,53.69 OK1.7
IN4P
  Top 0.406: JP4.1 74.23,55.63 73.01,55.63 72.5,55.12 70.47,55.12 69.87,55.71 R25.1
  Top 1.016: R25.1 67.17,56.13 67.1,56.2 OK1.8 67.17,56.44
IN5N
  Bottom 0.406: 69.73,53.36 R30.2 69.62,54.01 69.96,54.36 72.5,54.36 72.76,54.1 74.23,54.1 JP5.3
  Bottom 0.61: R30.2 69.52,53.44 69.38,53.44
  Bottom 0.813: 69.38,53.44 68.97,53.85 OK2.2
IN5P
  Bottom 0.406: JP5.1 74.23,55.63 73.01,55.63 72.5,55.12 69.96,55.12 69.62,55.46 R29.1
  Bottom 0.61: R29.1 69.59,56.11 69.59,55.98
  Bottom 0.813: 69.59,55.98 69.44,56.13 | OK2.1 67.36,56.13 R29.1
IN6N
  Bottom 0.406: JP6.3 74.23,50.55 69.71,50.55 69.16,51.35
  Bottom 0.813: R33.2 69.16,51.35 69.11,51.31 OK2.3
IN6P
  Bottom 0.406: JP6.1 73.98,49.02 69.45,49.02 69.11,48.68 69.11,48.51
  Bottom 0.813: R32.1 69.11,48.51 | 69.11,48.68 69.02,48.77 OK2.4
IN7N
  Bottom 0.406: JP7.3 74.23,43.94 69.71,43.94 69.2,43.43 69.11,43.43
  Bottom 0.813: R36.2 69.11,43.43 68.86,43.69 OK2.6
IN7P
  Bottom 0.406: 69.11,45.97 69.45,45.97 69.45,45.72 69.71,45.47 74.23,45.47 JP7.1
  Bottom 0.813: R35.1 69.11,45.97 68.86,46.23 OK2.5
IN8N
  Bottom 0.406: JP8.3 74.23,40.64 73.01,40.64 72.76,40.39 69.71,40.39 69.2,40.89 69.11,40.89
  Bottom 0.813: R38.2 69.11,40.89 68.86,41.15 OK2.7
IN8P
  Bottom 0.406: JP8.1 74.23,39.12 72.76,39.12 72.5,39.37 69.71,39.37 69.62,39.28 R37.1
  Bottom 0.813: R37.1 67.93,38.35 67.68,38.61 OK2.8
IN9N
  Top 0.406: JP9.3 75.25,15.75 73.52,15.75 73.26,15.49 70.98,15.49 70.64,15.84 R42.2
  Top 1.016: R42.2 70.13,16 OK3.2
IN9P
  Top 0.406: JP9.1 75.25,14.22 73.77,14.22 73.52,14.48 70.98,14.48 70.64,14.14 R41.1
  Top 1.016: OK3.1 R41.1
IN10N
  Top 0.406: JP10.3 75.25,19.05 71.23,19.05 70.64,18.45 R45.2
  Top 1.016: R45.2 70.13,18.54 OK3.3
IN10P
  Top 0.406: JP10.1 75.25,20.57 70.98,20.57 70.47,21.08 70.13,21.08
  Top 1.016: R44.1 70.13,21.08 OK3.4
IN11N
  Top 0.406: JP11.3 75.25,25.65 70.98,25.65 70.64,26 R48.2
  Top 1.016: R48.2 70.13,26.16 OK3.6
IN11P
  Top 0.406: JP11.1 75.25,24.13 70.98,24.13 70.64,23.79 R47.1
  Top 1.016: R47.1 70.13,23.62 OK3.5
IN12N
  Top 0.406: JP12.3 75.25,28.96 73.52,28.96 73.26,29.21 71.23,29.21 70.64,28.61 R50.2
  Top 1.016: R50.2 70.13,28.7 OK3.7
IN12P
  Top 0.406: JP12.1 75.25,30.48 73.52,30.48 73.26,30.23 70.72,30.23 70.64,30.31 R49.1
  Top 1.016: OK3.8 R49.1
N$1
  Top 0.305: IC1.1 19.34,23.58 24.78,23.58 R2.1
  Top 0.406: IC1.1 IC1.2
N$2
  Bottom 0.305: 81.44,21.67 81.65,21.87 D7.3
  Bottom 0.406: IC4.3 76.69,20.95 77.33,21.67 81.44,21.67 82.32,20.79 R57.2 82.66,20.92
N$3
  Top 0.305: R1.2 13.66,13 D1.3 13.7,14.27 13.7,19.81 14.35,20.46 IC1.3
N$4
  Bottom 0.406: IC4.2 77.96,20.95 78.09,21.08 80.12,21.08 80.38,20.83 80.38,17.53 74.03,11.18 69.8,11.18 R53.2 69.62,11.18 IC5.4
  Bottom 0.61: IC5.4 66.95,11.26
N$5
  Top 0.305: IC1.7 IC1.6 17.54,18.54 18.53,18.54 18.78,18.8 18.78,22.35 19.54,23.11 25.51,23.11 25.66,23.26 R2.2
N$6  (via drill 0.5)
  Top 0.406: v78.85,27.94 v77.07,27.94
  Bottom 0.406: v77.07,27.94 75.42,26.29 IC4.5 | R58.2 81.65,32.68 D8.3 80.21,29.29 v78.85,27.94
N$7
  Top 0.305: R4.2 18.23,13 D2.3 18.4,14.39 18.4,16.38 18.15,16.64 15.99,16.64 15.73,16.89 15.73,18.8 16.1,19.16 IC1.5
N$8
  Bottom 0.406: IC7.4 67.68,26.16 73.46,26.16 74.03,25.59 74.03,23.62 74.53,23.11 76.31,23.11 76.69,23.5 IC4.6
  Bottom 0.61: R59.2 67.8,25.27 67.68,25.4 67.68,26.16
N$9
  Top 0.305: IC1.8 IC1.9 23.32,18.54 19.8,18.54 19.42,18.92 19.42,22.23 19.8,22.61 25.64,22.61 26.16,23.13 R2.3
N$10
  Bottom 0.406: R56.1 51.8,18.25 | 51.8,18.25 IC6.2 | 51.8,18.25 51.67,18.12 51.67,16.73 C21.2 51.59,15.96 53.83,13.72 IC5.6
N$11
  Top 0.305: R6.2 22.8,13 D3.3 22.97,14.39 22.97,16.51 23.48,17.02 24.24,17.02 24.75,17.53 24.75,18.92 24.51,19.16 IC1.10
N$12
  Top 0.305: IC12.8 21.13,57.02 19.92,57.02 19.16,56.26 R80.1
N$13
  Top 0.305: IC1.13 IC1.14 23.69,22.1 25.89,22.1 26.66,22.86 R2.4
N$14
  Bottom 0.406: R16.1 11.33,54.01 11.42,54.1 | 11.42,54.1 11.42,54.9 Q1.3 | Q2.1 13.05,52.85 11.8,54.1 11.42,54.1
N$15
  Top 0.305: R8.2 27.37,13 D4.3 27.42,14.27 27.42,15.88 25.26,18.03 25.26,20.19 24.99,20.46 IC1.12
N$16
  Top 0.305: JP13.2 R1.1 R9.1
N$17
  Bottom 0.406: R72.2 R58.1 R71.2
N$18
  Top 0.305: X1.1 14.55,38.31 C32.2
  Top 0.406: IC13.8 15.94,39.37 X1.1
N$19
  Bottom 0.406: 86.81,32.17 R71.1
  Bottom 0.61: R71.1 87.58,31.24 JP18.2
N$20
  Bottom 0.406: R55.1 78.09,16.26 79.23,17.4 IC4.1
N$21
  Bottom 0.406: IC4.7 77.96,28.83 75.55,31.24 R61.1
N$22
  Top 0.305: R10.1 R4.1 JP14.2
N$23
  Bottom 0.61: JP17.2 R73.1
N$24
  Bottom 0.305: IC9.1 35.05,48.62 34.02,49.66 34.02,49.76 Y1.2
N$25
  Bottom 0.61: IC5.2 R55.2
N$26
  Bottom 0.61: IC7.2 R61.2
N$27
  Bottom 0.406: IC6.6 50.53,27.3 50.4,27.43 50.4,28.36 R62.1 C22.1 50.32,30.65 51.17,31.5 52.82,31.5 55.61,28.7 IC7.6
N$28
  Top 0.305: IC8.2 IC8.1 28.43,21.72 27.16,22.99 R2.5
N$29
  Top 0.305: R65.2 31.95,13 D5.3 31.99,14.27 31.99,18.67 31.48,19.18 IC8.3
N$31
  Top 0.305: X1.2 14.55,43.47 C33.1
  Top 0.406: IC13.7 17.13,40.64 15.73,42.04 15.73,43.05 15.48,43.31 15.05,43.31 X1.2
N$32
  Bottom 0.305: IC9.2 35.55,48.65 36.56,49.66 36.56,49.76 Y1.1
N$35
  Top 0.305: IC8.6 IC8.7 32.75,20.45 30.72,22.48 28.43,22.48 27.66,23.25 R2.6
N$36
  Top 0.305: R69.2 36.52,13 D6.3 36.56,14.27 36.56,17.14 35.8,17.91 IC8.5
N$37
  Top 0.305: IC13.2 23.48,46.99 25.13,48.64 IC12.4
N$38  (via drill 0.5)
  Top 0.305: v35.42,52.45 35.16,52.45 34.4,53.21 BT1.PWR@1
  Bottom 0.305: IC9.3 36.05,48.39 36.81,49.15 37.45,49.15 37.58,49.28 37.58,51.82 36.94,52.45 v35.42,52.45
N$39
  Bottom 0.305: IC9.9 35.55,42.17 35.16,41.78 R75.1
N$40
  Top 0.305: IC13.1 20.18,48.26 21.32,49.4 IC12.1
N$41
  Bottom 0.305: IC9.4 36.55,48.25 36.81,48.51 39.96,48.51 S1.2
N$42
  pour Route15 (isolate 0.406): 99.43,41.91 99.43,38.35 120.13,38.35 120.13,50.67 108.19,50.67
N$43
  Top 0.305: IC13.17 28.27,46.86 28.94,46.86 29.54,46.27 R81.1
N$46
  Top 0.305: IC10.1 93.06,62.36 93.84,62.36 94.56,61.63 C26.1
  Top 0.61: R5.2 95.27,61.59 C26.1
N$47
  Top 0.305: IC10.2 93.85,62.87 94.31,63.33 C26.2
  Top 0.61: R7.2 95.27,63.37 C26.2
N$50
  Top 0.305: IC10.4 93.83,63.87 94.73,64.77 94.94,64.77 R13.1 C28.2 C27.1 R14.1
N$52
  Top 0.305: IC10.9 89.53,62.87 89.77,63.12 89.77,64.52 | 89.77,64.52 89.77,64.9 90.79,65.91 JP21.2 | IC10.6 89.63,64.37 89.77,64.52
OD_LAMP_AUTO_P
  Top 0.61: JP9.2 77.33,14.99 77.84,14.48 77.84,13.72 74.03,9.91 J13.1
OD_LAMP_P
  Top 0.61: JP2.2 80.63,44.7 81.39,45.47 J6.4
OIL_PRESS_SW_N
  Top 0.61: JP1.2 82.66,39.88 83.25,40.47 J6.5
OUT1
  Top 0.305: IC3.21 45.65,40.46 46.09,40.89 54.81,40.89 R19.1 57.16,40.73 OK1.15
OUT2
  Top 0.305: IC3.22 45,40.57 46.09,41.66 53.45,41.66 53.71,41.91 53.71,42.93 54.38,43.6 R22.1 57.49,43.6 OK1.14
OUT3
  Top 0.305: IC3.23 44.35,40.68 46.09,42.42 52.94,42.42 53.2,42.67 53.2,50.55 53.54,50.89 R27.1 57.16,50.89 OK1.11
OUT4
  Top 0.305: IC3.24 43.7,41.05 45.83,43.18 52.18,43.18 52.44,43.43 52.44,53.09 53.36,54.01 R28.1 55.14,53.85 OK1.10
OUT5  (via drill 0.5)
  Top 0.305: IC3.28 41.01,39.28 41.01,42.42 45.07,46.48 48.12,46.48 50.91,49.28 v50.91,49.53
  Bottom 0.305: v50.91,49.53 53.2,51.82 53.2,52.83 54.38,54.01 R31.1 55.14,53.85 OK2.15
OUT6  (via drill 0.5)
  Top 0.305: IC3.27 41.77,39.2 41.77,42.16 45.32,45.72 48.88,45.72 v50.91,47.75
  Bottom 0.305: v50.91,47.75 54.05,50.89 R34.1 | 55.14,51.05 57.01,51.05
  Bottom 0.406: R34.1 55.14,51.05 | 57.01,51.05 57.26,51.31 OK2.14
OUT7  (via drill 0.5)
  Top 0.305: IC3.26 42.4,41.78 45.58,44.96 49.9,44.96 v50.91,45.97
  Bottom 0.305: v50.91,45.97 51.93,45.97 54.21,43.69 54.89,43.69 R39.1 57.49,43.6 OK2.11
OUT8  (via drill 0.5)
  Top 0.305: IC3.25 43.04,41.4 45.83,44.2 v50.91,44.2
  Bottom 0.305: v50.91,44.2 54.38,40.73 R40.1 57.16,40.73 OK2.10
OUT9
  Top 0.305: OK3.15 57.67,15.84 R43.1 54.89,15.84 53.71,17.02 53.71,18.54 50.66,21.59 50.66,24.13 50.4,24.38 43.04,24.38 41.1,26.32 IC3.1
OUT10
  Top 0.305: IC3.2 41.77,31.92 41.77,26.67 43.29,25.15 50.91,25.15 51.42,24.64 51.42,21.84 54.56,18.71 R46.1 57.67,18.71 OK3.14
OUT11
  Top 0.305: IC3.3 42.4,27.05 43.67,25.78 54.76,25.78 R51.1 57.67,26 OK3.11
OUT12
  Top 0.305: IC3.4 43.04,31.92 43.04,27.43 44.05,26.42 53.45,26.42 54.98,27.94 R52.1 57.67,28.87 OK3.10
PARKING_BRAKE_N
  Top 0.61: JP11.2 78.6,24.89 90.92,12.57 90.92,9.9 J7.2
SCL  (via drill 0.5)
  Top 0.305: v45.58,34.8 47.86,34.8 48.25,34.41 IC3.12
  Bottom 0.305: J1.5 5.64,13.72 7.6,13.72 8.37,14.61 8.37,30.35 13.07,34.8 36.94,34.8 | 36.94,34.8 v45.58,34.8 | IC9.7 36.55,35.19 36.94,34.8
SDA  (via drill 0.5)
  Top 0.305: IC3.13 48.88,31.95 48.88,35.31 v48.63,35.56 | v37.45,35.69 37.45,34.67 v36.81,34.04
  Bottom 0.305: J1.3 9,14.29 9,29.97 13.32,34.04 v36.81,34.04 46.59,34.04 48.12,35.56 v48.63,35.56 | IC9.6 37.05,36.08 v37.45,35.69
SENSOR1_IN
  Top 0.305: J2.4 14.1,6.2 13.5,6.81 JP13.1
SENSOR2_IN
  Top 0.305: J2.3 23.23,7.49 19.04,7.49 18.65,7.87 JP14.1
SENSOR3_IN
  Top 0.305: J2.2 27.04,6.22 27.04,8.26 26.4,8.89 21.96,8.89 21.83,9.02 R6.1 R11.1
SENSOR4_IN
  Top 0.305: J2.1 29.45,6.27 29.45,6.48 26.4,9.53 R8.1 R12.1
SENSOR5_IN
  Top 0.305: J2.5 30.97,5.16 R65.1 R63.1
SENSOR6_IN
  Top 0.305: J2.6 28.31,2.41 30.97,2.41 31.61,3.05 31.61,8.13 33.81,10.33 R67.1 R69.1
SIG_3V3_IN1  (via drill 0.5)
  Top 0.305: IC2.7 32.37,29.43 v32.37,28.19
  Bottom 0.305: v32.37,28.19 32.37,27.3 36.69,23.11 52.18,23.11 53.07,22.23 IC6.1
  Bottom 0.406: IC6.1 53.07,18.25 R56.2 C21.1
SIG_3V3_IN2  (via drill 0.5)
  Top 0.305: IC2.8 33.89,29.43 v33.89,28.19
  Bottom 0.305: v33.89,28.19 33.89,27.3 37.45,23.88 51.17,23.88 51.8,24.51 IC6.7
  Bottom 0.406: IC6.7 51.8,27.3 52.18,27.69 52.18,28.28 R62.2 C22.2
SPI_CE0_N  (via drill 0.5)
  Top 0.305: v8.49,39.62 6.59,37.72 4.3,37.72 3.02,36.44 J1.24
  Bottom 0.305: JP22.3 9.97,36.32 8.75,36.32 7.35,37.72 4.3,37.72 3.02,36.44 J1.24 | JP16.3 9.94,39.62 v8.49,39.62
SPI_CE1_N
  Bottom 0.305: JP16.1 9.97,41.27 8.49,41.27 7.48,40.26 7.22,40.26 | 7.22,40.26 4.05,40.26 2.96,39.17 J1.26 | JP22.1 9.97,37.85 8.49,37.85 7.22,39.12 7.22,40.26
SPI_CLK
  Top 0.305: J1.23 8.67,32.26 27.29,32.26 28.69,33.66 IC2.13 28.69,35.69 29.45,36.45 29.45,41.53 29.2,41.91 IC13.13
SPI_MISO  (via drill 0.5)
  Top 0.305: J1.21 5.62,33.78 6.72,33.78 8.24,31.75 27.8,31.75 29.96,33.91 IC2.12 29.96,36.07 30.34,36.45 v30.34,41.53 | v30.34,43.94 29.83,44.45 IC13.15
  Bottom 0.305: v30.34,41.53 v30.34,43.94
SPI_MOSI
  Top 0.305: J1.19 5.38,31.24 28.31,31.24 31.23,34.16 IC2.11 31.23,42.04 30.08,43.18 IC13.14
USER_IN1  (via drill 0.5)
  Top 0.305: IC3.5 43.7,28.04 v44.18,27.56 | R64.2 43.8,18.16 J9.5
  Route15 0.305: J9.5 42.53,19.47 42.53,21.84 44.18,23.5 v44.18,27.56
USER_IN2  (via drill 0.5)
  Top 0.305: IC3.6 44.35,28.53 v45.32,27.56 | R66.2 45.58,17.02 45.07,17.53 45.07,19.18 44.94,19.3 44.94,19.56 J9.2
  Route15 0.305: v45.32,27.56 45.32,23.88 43.82,22.37 J9.2
USER_IN3  (via drill 0.5)
  Top 0.305: IC3.7 45,29.03 v46.47,27.56 | J9.1 46.32,20.34 49.13,17.53 R68.2
  Route15 0.305: v46.47,27.56 46.47,20.83 J9.1
USER_IN4  (via drill 0.5)
  Top 0.305: IC3.8 45.65,29.52 v47.61,27.56 | J9.4 46.36,17.51 47.36,16.51 R70.2
  Route15 0.305: v47.61,27.56 47.61,19.43 J9.4
VCCA
  Top 0.305: C25.1 87.72,62.37 IC10.10 89.66,62.37 90.28,62.99 90.28,64.39 91.55,65.79 91.55,66.62 JP21.3
  Top 0.61: 95.23,68.6 IC11.2 95.12,68.49 C23.1 93.42,68.71 92.7,68.71 91.6,67.61 JP21.3 | 95.23,68.6 R13.2 | 95.23,68.6 95.09,68.75
VSS+  (via drill 0.5)
  Top 0.305: R5.1 114.41,61.59 v115.17,62.36
  Bottom 0.305: J11.G v115.17,62.36
VSS-  (via drill 0.5)
  Top 0.305: v109.84,62.36 100.57,62.36 | 100.57,62.36 99.55,63.37 R7.1 | 100.57,62.36 101.69,63.48 JP15.1
  Bottom 0.305: J11.1 109.97,66.67 109.97,62.36 v109.84,62.36

## Text on the board
tPlace: CANH | CANL | +3.3V | TACH | GND
tNames: GND | 12V Switched | FUSE 8 | FUSE 16 | GND | Volvo 240 Pi Dash Adapter / Rev C. May 2022 / @whitfijs | GND